# EAGLE schematic main-board (EAGLE 9.3.0)
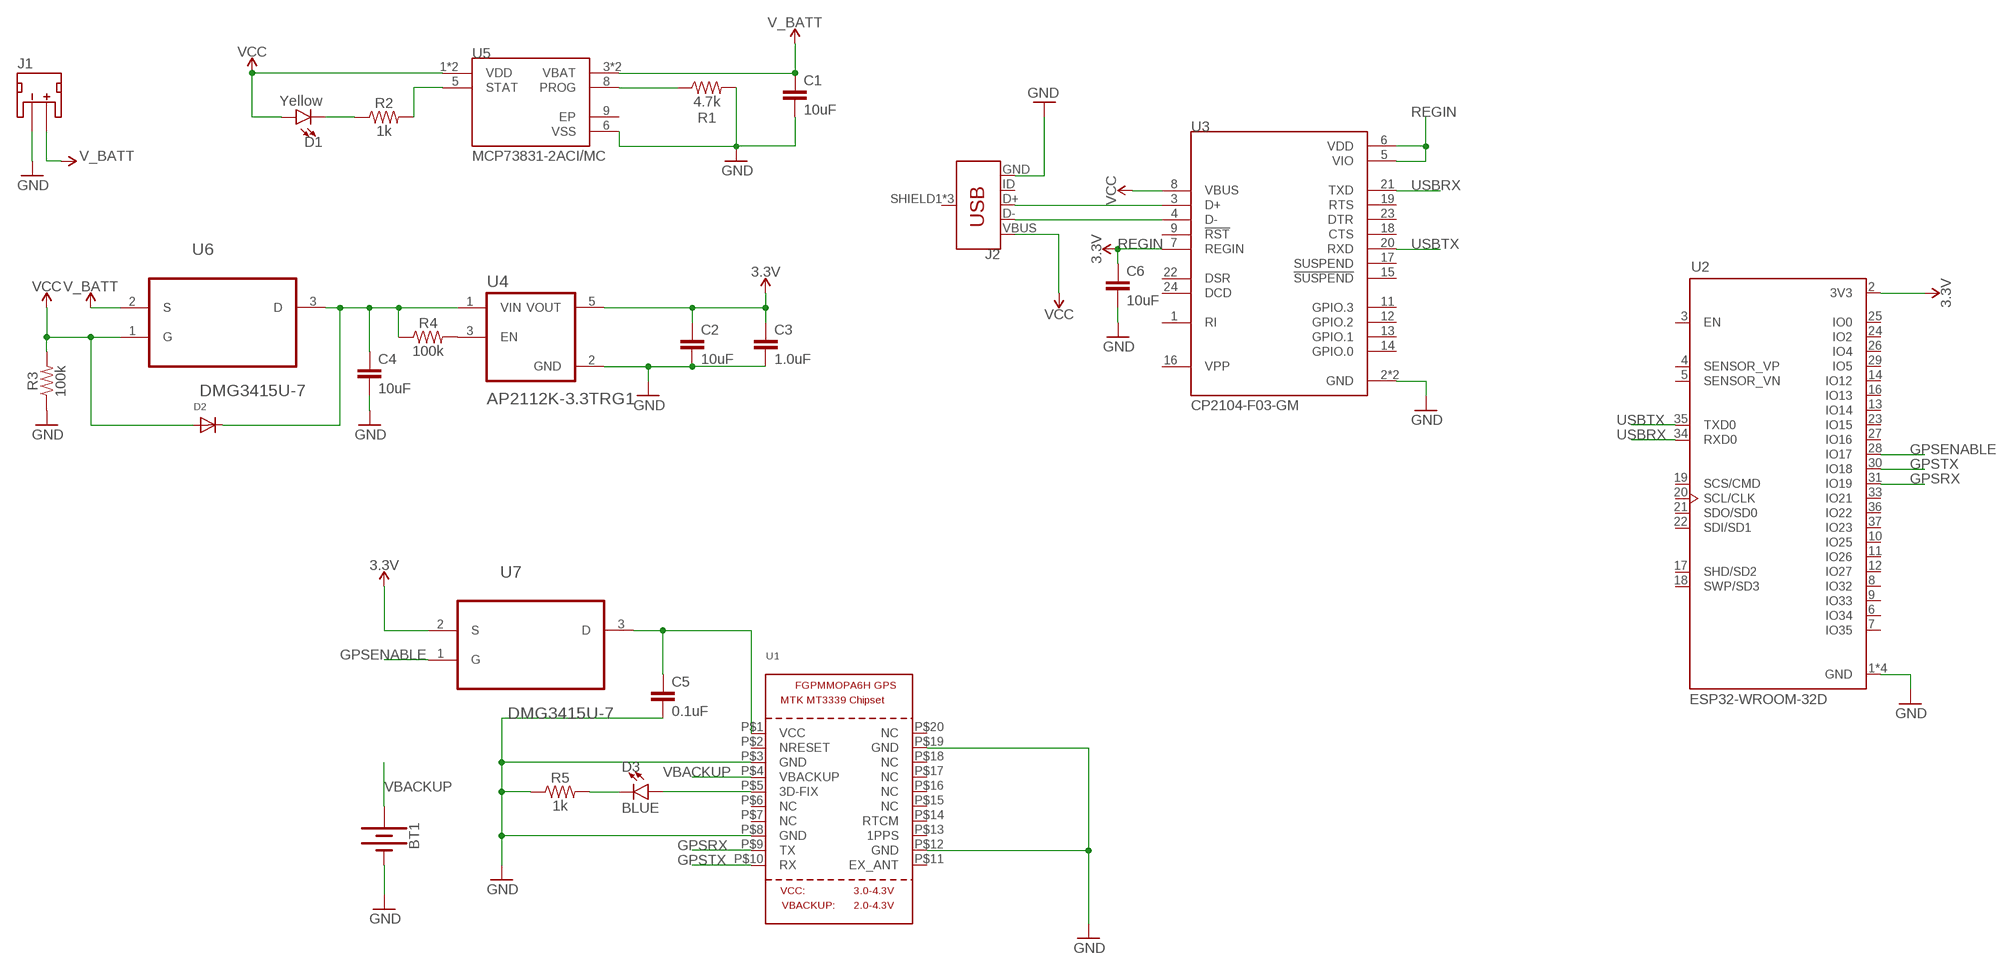
[diagram p0: schematic, sheet 1]

## Parts
BT1  BATTERY-20MM_PTH  [BATTCOM_20MM_PTH]
C1  10uF  10UF-0805-10V-10%  [0805]
C2  10uF  10UF-0805-10V-10%  [0805]
C3  1.0uF  1.0UF-0805-25V-(+80/-20%)  [0805]
C4  10uF  10UF-0805-10V-10%  [0805]
C5  0.1uF  0.1UF-0603-25V-(+80/-20%)  [0603]
C6  10uF  10UF-0805-10V-10%  [0805]
D1  Yellow  LED-YELLOW0603  [LED-0603]
D2  DIODESOD-123  [SOD-123]
D3  BLUE  LED-BLUE0603  [LED-0603]
J1  JST_2MM_MALE  [JST-2-SMD]
J2  USB_MICRO-B_FEMALE-SMT  [USB-B-MICRO-SMD]
R1  4.7k  4.7KOHM-0603-1/10W-1%  [0603]
R2  1k  1KOHM-0603-1/10W-1%  [0603]
R3  100k  100KOHM-0603-1/10W-1%  [0603]
R4  100k  100KOHM-0603-1/10W-1%  [0603]
R5  1k  1KOHM-0603-1/10W-1%  [0603]
U1  GPS_FGPMMOPA6H  [FGPMMOPA6H]
U2  ESP32-WROOM-32D  [MODULE_ESP32-WROOM-32D]
U3  CP2104-F03-GM  [QFN50P400X400X80-25N]
U4  AP2112K-3.3TRG1  [SOT95P285X140-5N]
U5  MCP73831-2ACI/MC  [SON50P200X300X100-9N]
U6  DMG3415U-7  [SOT95P240X105-3N]
U7  DMG3415U-7  [SOT95P240X105-3N]

## Nets
3.3V: C2.1 C3.1 U2.2(3V3) U4.5(VOUT) U7.2(S)
GND: BT1.2(-) C1.2 C2.2 C3.2 C4.2 C5.2 C6.2 J1.1(-) J2.GND R1.2 R3.1 R5.1 U1.P$3(GND) U1.P$8(GND) U1.P$12(GND) U1.P$19(GND) U2.1(GND) U2.15(GND) U2.38(GND) U2.39(GND) U3.2(GND) U3.25(GND) U4.2(GND) U5.6(VSS)
GPSENABLE: U2.28(IO17) U7.1(G)
GPSRX: U1.P$9(TX) U2.31(IO19)
GPSTX: U1.P$10(RX) U2.30(IO18)
N$1: R1.1 U5.8(PROG)
N$2: R2.2 U5.5(STAT)
N$3: D1.C R2.1
N$4: C4.1 D2.C R4.1 U4.1(VIN) U6.3(D)
N$5: R4.2 U4.3(EN)
N$6: C5.1 U1.P$1(VCC) U7.3(D)
N$7: D3.A U1.P$5(3D-FIX)
N$8: D3.C R5.2
N$9: J2.D+ U3.3(D+)
N$10: J2.D- U3.4(D-)
REGIN: C6.1 U3.5(VIO) U3.6(VDD) U3.7(REGIN) ; supply symbol labelled 3.3V
USBRX: U2.34(RXD0) U3.21(TXD)
USBTX: U2.35(TXD0) U3.20(RXD)
V_BATT: C1.1 J1.2(+) U5.3(VBAT) U5.4(VBAT) U6.2(S)
VBACKUP: BT1.1(+) U1.P$4(VBACKUP)
VCC: D1.A D2.A J2.VBUS R3.2 U3.8(VBUS) U5.1(VDD) U5.2(VDD) U6.1(G)
Unconnected: J1.NC1(PAD1) J1.NC2(PAD2) J2.ID J2.SHIELD1(SHIELD) J2.SHIELD2(SHIELD) J2.SHIELD3(SHIELD) U1.P$2(NRESET) U1.P$6(NC) U1.P$7(NC) U1.P$11(EX_ANT) U1.P$13(1PPS) U1.P$14(RTCM) U1.P$15(NC) U1.P$16(NC) U1.P$17(NC) U1.P$18(NC) U1.P$20(NC) U2.3(EN) U2.4(SENSOR_VP) U2.5(SENSOR_VN) U2.6(IO34) U2.7(IO35) U2.8(IO32) U2.9(IO33) U2.10(IO25) U2.11(IO26) U2.12(IO27) U2.13(IO14) U2.14(IO12) U2.16(IO13) U2.17(SHD/SD2) U2.18(SWP/SD3) U2.19(SCS/CMD) U2.20(SCL/CLK) U2.21(SDO/SD0) U2.22(SDI/SD1) U2.23(IO15) U2.24(IO2) U2.25(IO0) U2.26(IO4) U2.27(IO16) U2.29(IO5) U2.33(IO21) U2.36(IO22) U2.37(IO23) U3.1(RI) U3.9(!RST) U3.11(GPIO.3) U3.12(GPIO.2) U3.13(GPIO.1) U3.14(GPIO.0) U3.15(!SUSPEND) U3.16(VPP) U3.17(SUSPEND) U3.18(CTS) U3.19(RTS) U3.22(DSR) U3.23(DTR) U3.24(DCD)

## Power pins joined to a net without a drawn wire
EP: U5.9(EP)

## Library data of the parts
BT1 = SparkFun-Batteries:BATTERY: Battery - Single Cell A variety of battery chemistries, sizes, and footprints. Device List: 20MM_PTH - Coin Cell Battery Holder - 20mm (PTH) <https://www.sparkfun.com/products/783> 6.8MM_PTH - Coin Cell Battery Holder - 6.8MM(SMD) <https://www.digikey.com/product-detail/en/seiko-instruments/MS621FE-FL11E/728-1057-ND/1889208?WT.srch=1&gclid=CNOQ5a6LzdQCFZS2wAodXCkE0g> 12MM_SMD - Coin Cell Battery Holder - 12mm (SMD) <https://www.sparkfun.com/products/10592> 12MM_PTH - Coin Cell Battery Holder - 12mm (PTH) <https://www.sparkfun.com/products/7948> 20MM_SMD - 20mm Coin Cell Battery Holder (SMD) (2 legs) Used on the Big Time Watch Kit <https://www.sparkfun.com/products/11734> 20MM_SMD_4LEGS - Coin Cell Battery Holder - 20mm (SMD) <https://www.sparkfun.com/products/11892> 20MM_SMD_4LEGS_OVERPASTE - Coin Cell Battery Holder - 20mm (SMD) <https://www.sparkfun.com/products/11892> (Over-paste on the legs) 24.5MM_PTH - Coin Cell Battery Holder - 24.5mm (PTH) <https://www.sparkfun.com/products/8863> 9V - 9V Battery Holder - PC Mount Used on the SparkFun SparkPunk Sound Kit <https://www.sparkfun.com/products/11177> and SparkFun SparkPunk Sequencer Kit <https://www.sparkfun.com/products/12707> 18650 - Battery Holder - 18650 (PTH) <https://www.sparkfun.com/products/13113> AA - Battery Holder - 1xAA (PTH) <https://www.sparkfun.com/products/7949> AAA - Battery Holder - 1xAAA (PTH) <https://www.sparkfun.com/products/12718> AA_KIT - Battery Holder - 1xAA (PTH) <https://www.sparkfun.com/products/7949> Special kit package - pads only have exposed copper on one side of the board. AAA_KIT - Battery Holder - 1xAAA (PTH) <https://www.sparkfun.com/products/12718> Special kit package - pads only have exposed copper on one side of the board.; PROD_ID: BATT-09031; SF_SKU: PRT-00783
C1 C2 C4 C6 = SparkFun-Capacitors:10UF: 10.0µF ceramic capacitors A capacitor is a passive two-terminal electrical component used to store electrical energy temporarily in an electric field.; PROD_ID: CAP-11330
C3 = SparkFun-Capacitors:1.0UF: 1µF ceramic capacitors A capacitor is a passive two-terminal electrical component used to store electrical energy temporarily in an electric field.; PROD_ID: CAP-11625
C5 = SparkFun-Capacitors:0.1UF: 0.1µF ceramic capacitors A capacitor is a passive two-terminal electrical component used to store electrical energy temporarily in an electric field.; PROD_ID: CAP-00810
D1 = SparkFun-LED:LED-YELLOW: Yellow SMD LED Used in manufacturing several products at SparkFun. Packages: 0603 - SMD 0603 package[Product Link] <http://www.kingbrightusa.com/product.asp?catalog_name=LED&product_id=APT1608SYCK> 0603 -SMART - SMART SMD 0603 package (more efficient/more expensive) [Product Link] <http://www.osram-os.com/osram_os/en/products/product-catalog/led-light-emitting-diodes/smartled-0603/ly-l29k/index.jsp> LilyPad - SMD1206 package[Product Datasheet] <https://www.sparkfun.com/datasheets/DevTools/LilyPad/Q150YUS4.pdf> SparkFun Products: Blynk Board <https://www.sparkfun.com/products/13794> IOIO-OTG <https://www.sparkfun.com/products/13613> XBee Explorer Serial <https://www.sparkfun.com/products/13225>; PROD_ID: DIO-09003
D2 = adafruit:DIODE: Diode SMADIODE - SMA Surface Mount Package 20V 1A Schottky Diode Digikey: 641-1014-6-ND DO-1N4148 - Through Hole Small Current Diode SOD-123 20V 1 A (.5mV Vf) Schottky Diode - Digikey: MBRX120TPMSCT-ND SOD-323 10V 570mA (.38mV Vf, 3ns) Schottky Diode - Digikey: ZLLS410CT-ND SOD-523 30V 30mA Schottky Diode (RB751S-40TE61) - Digikey: RB751S-40TE61CT-ND SOT23-R/W - SOT23 Package (R = Solder Paste/Reflow Ovens, W = Hand-Soldering) BAT54Film 40V 300mA - Digikey: 497-7162-1-ND
D3 = SparkFun-LED:LED-BLUE: Blue SMD LED Used in manufacturing of various products at SparkFun Packages: 0603 - SMD 0603 package [Product Link] <http://www.digikey.com/product-detail/en/SMLE12BC7TT86/511-1589-2-ND/1641808> 1206 - SMD1206 package [Product Link] <http://www.digikey.com/product-detail/en/lite-on-inc/LTST-C150TBKT/160-1643-1-ND/573584> SparkFun Products: ESP8266 Thing-Dev Board <https://www.sparkfun.com/products/13711> RedBoard <https://www.sparkfun.com/products/12757>; PROD_ID: DIO-08575
J1 = SparkFun-Connectors:JST_2MM_MALE: JST 2MM MALE RA CONNECTOR Two pin, compact surface mount connector. Commonly used as a battery input connection point. We really like the solid locking feeling and high current rating on these small connectors. We use these all the time as battery connectors. Mates to single-cell LiPo batteries. Here is the connector we sell at SparkFun: JST Right Angle Connector - White <https://www.sparkfun.com/products/8612> (PRT-08612) Datasheet <http://www.sparkfun.com/datasheets/Prototyping/Connectors/JST-Horizontal.pdf> It was used on these SparkFun products: SparkFun MOSFET Power Controller <https://www.sparkfun.com/products/11214> (PRT-11214) SparkFun Battery Babysitter - LiPo Battery Manager <https://www.sparkfun.com/products/13777> (PRT-13777) And many, many others that required a lipo battery connection.; PROD_ID: CONN-11443; SF_ID: PRT-08612
J2 = SparkFun-Connectors:USB_MICRO-B: USB Type Micro-B Connector Male/female and PTH/SMT variants SparkFun Products: SparkFun microB USB Breakout <https://www.sparkfun.com/products/12035> SparkFun USB microB Plug Breakout <https://www.sparkfun.com/products/10031> SparkFun ESP8266 Thing <https://www.sparkfun.com/products/13231>; PROD_ID: CONN-11752
R1 = SparkFun-Resistors:4.7KOHM: 4.7kΩ resistor A resistor is a passive two-terminal electrical component that implements electrical resistance as a circuit element. Resistors act to reduce current flow, and, at the same time, act to lower voltage levels within circuits. - Wikipedia; PROD_ID: RES-07857
R2 R5 = SparkFun-Resistors:1KOHM: 1kΩ resistor A resistor is a passive two-terminal electrical component that implements electrical resistance as a circuit element. Resistors act to reduce current flow, and, at the same time, act to lower voltage levels within circuits. - Wikipedia; PROD_ID: RES-07856
R3 R4 = SparkFun-Resistors:100KOHM: 100kΩ resistor A resistor is a passive two-terminal electrical component that implements electrical resistance as a circuit element. Resistors act to reduce current flow, and, at the same time, act to lower voltage levels within circuits. - Wikipedia; PROD_ID: RES-07828
U1 = adafruit:GPS_FGPMMOPA6H: GPS Module - MTK MT3339 Chipset, -165dBm sensitivity, 22 channels, 10Hz, auto-select external antenna options; OC_NEWARK: unknown
U2 = SnapEDA-Library:ESP32-WROOM-32D: IC: SoC; GPIO, I2C, I2S, IR, SD, SDIO, SPI, UART; 2.7÷3.6VDC; 20dBm; MANUFACTURER: Espressif Systems; PARTREV: 1.5; STANDARD: Manufacturer Recommendation
U3 = SnapEDA-Library:CP2104-F03-GM: USB-to-UART 1-CH 576byte FIFO 3.3V 24-Pin QFN EP T/R; MANUFACTURER: Silicon Labs; PARTREV: 1.2; STANDARD: IPC7351B
U4 = SnapEDA-Library:AP2112K-3.3TRG1: AP2112 Series 0.6 A 3.3 V Fixed Output SMT LDO Linear Regulator - SOT23-5; MANUFACTURER: Diodes Inc.; PARTREV: 2-2
U5 = SnapEDA-Library:MCP73831-2ACI/MC: MCP73831 Series Single-Cell Li-Ion/Li-Polymer Battery Charge Controller - DFN-8; MANUFACTURER: MICROCHIP; PARTREV: G; STANDARD: IPC 7351B
U6 U7 = SnapEDA-Library:DMG3415U-7: P-CHANNEL ENHANCEMENT MODE MOSFET; MPN: DMG3415U-7; OC_FARNELL: 1843688; OC_NEWARK: 12T2026; PACKAGE: SOT-23-3; SUPPLIER: Diodes Inc